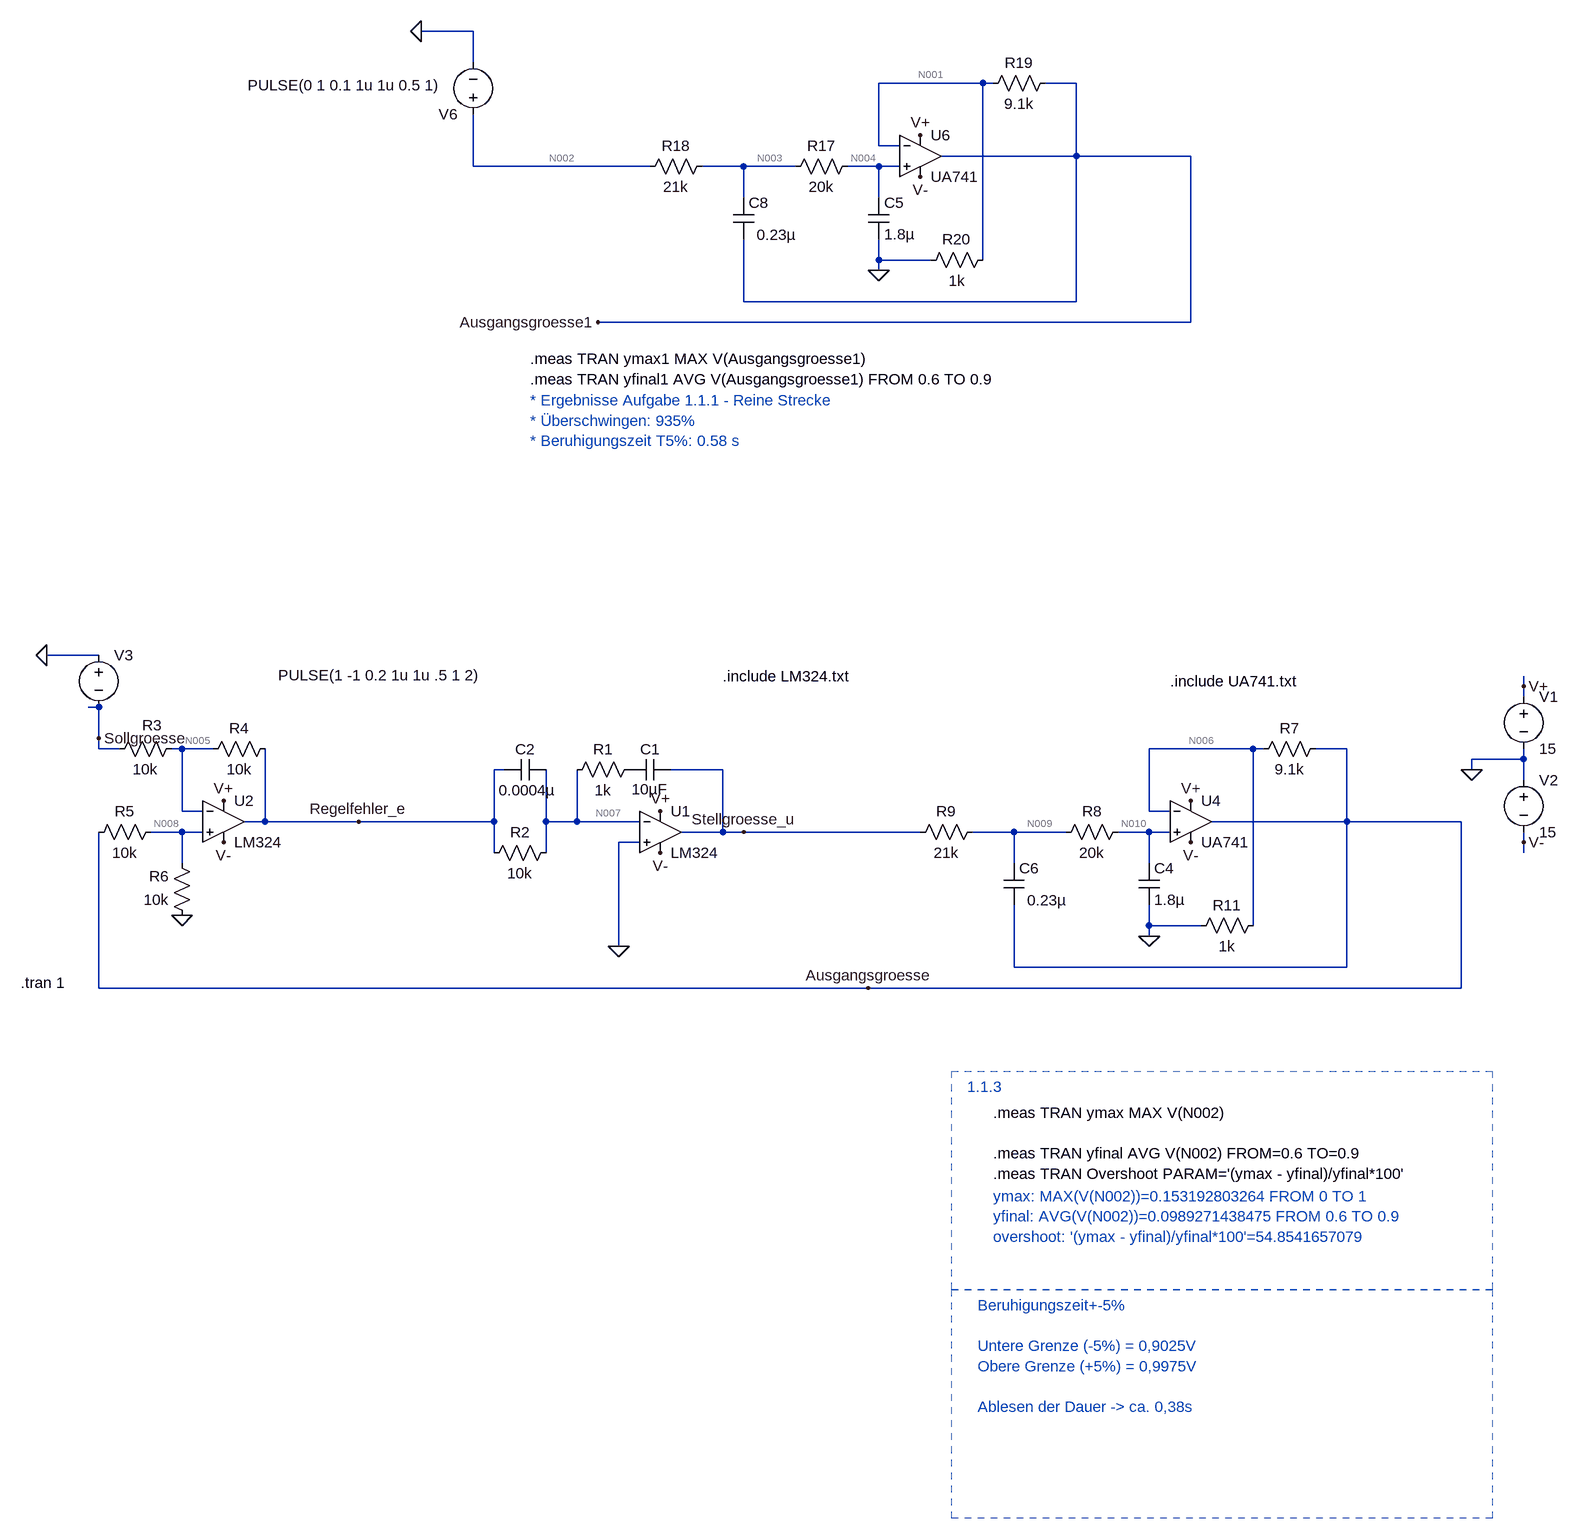
[diagram p0: schematic Reglerkreis_neu_vorlage.asc]
Reglerkreis_neu_vorlage.asc, the LTspice schematic file:
Version 4.1
SHEET 1 1480 1944
WIRE -464 -1056 -544 -1056
WIRE -464 -1008 -464 -1056
WIRE 320 -976 160 -976
WIRE 336 -976 320 -976
WIRE 464 -976 416 -976
WIRE 160 -880 160 -976
WIRE 192 -880 160 -880
WIRE 464 -864 464 -976
WIRE 464 -864 256 -864
WIRE 640 -864 464 -864
WIRE -464 -848 -464 -928
WIRE -192 -848 -464 -848
WIRE -48 -848 -112 -848
WIRE 32 -848 -48 -848
WIRE 160 -848 112 -848
WIRE 192 -848 160 -848
WIRE -48 -800 -48 -848
WIRE 160 -800 160 -848
WIRE 160 -704 160 -736
WIRE 240 -704 160 -704
WIRE 320 -704 320 -976
WIRE 160 -688 160 -704
WIRE -48 -640 -48 -736
WIRE 464 -640 464 -864
WIRE 464 -640 -48 -640
WIRE 640 -608 640 -864
WIRE 640 -608 -272 -608
WIRE -1040 -96 -1120 -96
WIRE 1152 -48 1152 -64
WIRE 1152 -32 1152 -48
WIRE -1040 -16 -1056 -16
WIRE -1040 32 -1040 -16
WIRE -1040 48 -1040 32
WIRE -1008 48 -1040 48
WIRE -912 48 -928 48
WIRE -864 48 -912 48
WIRE 736 48 576 48
WIRE 752 48 736 48
WIRE 880 48 832 48
WIRE 1152 64 1152 48
WIRE 1152 64 1072 64
WIRE -416 80 -432 80
WIRE -80 80 -160 80
WIRE 1072 80 1072 64
WIRE 1152 96 1152 64
WIRE -912 144 -912 48
WIRE -880 144 -912 144
WIRE 576 144 576 48
WIRE 608 144 576 144
WIRE -784 160 -784 48
WIRE -784 160 -816 160
WIRE -640 160 -784 160
WIRE -432 160 -432 80
WIRE -432 160 -640 160
WIRE -352 160 -352 80
WIRE -304 160 -304 80
WIRE -304 160 -352 160
WIRE -208 160 -304 160
WIRE 880 160 880 48
WIRE 880 160 672 160
WIRE 1056 160 880 160
WIRE -912 176 -960 176
WIRE -880 176 -912 176
WIRE -80 176 -80 80
WIRE -80 176 -144 176
WIRE -48 176 -80 176
WIRE 224 176 -48 176
WIRE 368 176 304 176
WIRE 448 176 368 176
WIRE 576 176 528 176
WIRE 608 176 576 176
WIRE -208 192 -240 192
WIRE 1152 192 1152 176
WIRE -432 208 -432 160
WIRE -352 208 -352 160
WIRE 1152 208 1152 192
WIRE -912 224 -912 176
WIRE 368 224 368 176
WIRE 576 224 576 176
WIRE 576 320 576 288
WIRE 656 320 576 320
WIRE 736 320 736 48
WIRE 576 336 576 320
WIRE -240 352 -240 192
WIRE 368 384 368 288
WIRE 880 384 880 160
WIRE 880 384 368 384
WIRE -1040 416 -1040 176
WIRE 144 416 -1040 416
WIRE 1056 416 1056 160
WIRE 1056 416 144 416
FLAG 1072 80 0
FLAG 1152 -48 V+
FLAG 1152 192 V-
FLAG -176 144 V+
FLAG -176 208 V-
FLAG -48 176 Stellgroesse_u
FLAG -848 128 V+
FLAG 640 128 V+
FLAG -848 192 V-
FLAG 640 192 V-
FLAG -912 304 0
FLAG -640 160 Regelfehler_e
FLAG 576 336 0
FLAG -1120 -96 0
FLAG 144 416 Ausgangsgroesse
FLAG -240 352 0
FLAG -1040 32 Sollgroesse
FLAG 224 -896 V+
FLAG 224 -832 V-
FLAG 160 -688 0
FLAG -544 -1056 0
FLAG -272 -608 Ausgangsgroesse1
SYMBOL voltage 1152 -48 R0
WINDOW 123 0 0 Left 2
WINDOW 39 0 0 Left 2
SYMATTR InstName V1
SYMATTR Value 15
SYMBOL voltage 1152 80 R0
WINDOW 123 0 0 Left 2
WINDOW 39 0 0 Left 2
SYMATTR InstName V2
SYMATTR Value 15
SYMBOL Opamps\\opamp2 -176 112 R0
SYMATTR InstName U1
SYMATTR Value LM324
SYMBOL res -208 64 R90
WINDOW 0 0 56 VBottom 2
WINDOW 3 32 56 VTop 2
SYMATTR InstName R1
SYMATTR Value 1k
SYMBOL res -336 192 R90
WINDOW 0 0 56 VBottom 2
WINDOW 3 32 56 VTop 2
SYMATTR InstName R2
SYMATTR Value 10k
SYMBOL cap -160 64 R90
WINDOW 0 0 32 VBottom 2
WINDOW 3 46 32 VCenter 2
SYMATTR InstName C1
SYMATTR Value 10µF
SYMBOL Opamps\\opamp2 -848 96 R0
SYMATTR InstName U2
SYMATTR Value LM324
SYMBOL res -912 32 R90
WINDOW 0 -5 46 VBottom 2
WINDOW 3 32 56 VTop 2
SYMATTR InstName R3
SYMATTR Value 10k
SYMBOL res -768 32 R90
WINDOW 0 0 56 VBottom 2
WINDOW 3 32 56 VTop 2
SYMATTR InstName R4
SYMATTR Value 10k
SYMBOL res -944 160 R90
WINDOW 0 0 56 VBottom 2
WINDOW 3 32 56 VTop 2
SYMATTR InstName R5
SYMATTR Value 10k
SYMBOL res -896 320 R180
WINDOW 0 36 76 Left 2
WINDOW 3 36 40 Left 2
SYMATTR InstName R6
SYMATTR Value 10k
SYMBOL res 544 160 R90
WINDOW 0 0 56 VBottom 2
WINDOW 3 32 56 VTop 2
SYMATTR InstName R8
SYMATTR Value 20k
SYMBOL res 320 160 R90
WINDOW 0 0 56 VBottom 2
WINDOW 3 32 56 VTop 2
SYMATTR InstName R9
SYMATTR Value 21k
SYMBOL cap 560 224 R0
SYMATTR InstName C4
SYMATTR Value 1.8µ
SYMBOL voltage -1040 -112 R0
WINDOW 123 0 0 Left 2
WINDOW 39 0 0 Left 2
WINDOW 3 276 47 Left 2
SYMATTR Value PULSE(1 -1 0.2 1u 1u .5 1 2)
SYMATTR InstName V3
SYMBOL cap -352 64 R90
WINDOW 0 0 32 VBottom 2
WINDOW 3 32 29 VTop 2
SYMATTR InstName C2
SYMATTR Value 0.0004µ
SYMBOL cap 352 224 R0
WINDOW 3 36 57 Left 2
SYMATTR Value 0.23µ
SYMATTR InstName C6
SYMBOL res 848 32 R90
WINDOW 0 0 56 VBottom 2
WINDOW 3 32 56 VTop 2
SYMATTR InstName R7
SYMATTR Value 9.1k
SYMBOL res 752 304 R90
WINDOW 0 0 56 VBottom 2
WINDOW 3 32 56 VTop 2
SYMATTR InstName R11
SYMATTR Value 1k
SYMBOL Opamps\\opamp2 640 96 R0
SYMATTR InstName U4
SYMATTR Value UA741
SYMBOL res 128 -864 R90
WINDOW 0 0 56 VBottom 2
WINDOW 3 32 56 VTop 2
SYMATTR InstName R17
SYMATTR Value 20k
SYMBOL res -96 -864 R90
WINDOW 0 0 56 VBottom 2
WINDOW 3 32 56 VTop 2
SYMATTR InstName R18
SYMATTR Value 21k
SYMBOL cap 144 -800 R0
SYMATTR InstName C5
SYMATTR Value 1.8µ
SYMBOL voltage -464 -912 R180
WINDOW 123 0 0 Left 2
WINDOW 39 0 0 Left 2
WINDOW 3 50 61 Left 2
SYMATTR Value PULSE(0 1 0.1 1u 1u 0.5 1)
SYMATTR InstName V6
SYMBOL cap -64 -800 R0
WINDOW 3 36 57 Left 2
SYMATTR Value 0.23µ
SYMATTR InstName C8
SYMBOL res 432 -992 R90
WINDOW 0 0 56 VBottom 2
WINDOW 3 32 56 VTop 2
SYMATTR InstName R19
SYMATTR Value 9.1k
SYMBOL res 336 -720 R90
WINDOW 0 0 56 VBottom 2
WINDOW 3 32 56 VTop 2
SYMATTR InstName R20
SYMATTR Value 1k
SYMBOL Opamps\\opamp2 224 -928 R0
SYMATTR InstName U6
SYMATTR Value UA741
TEXT -80 -64 Left 2 !.include LM324.txt
TEXT -1160 408 Left 2 !.tran 1
TEXT 608 -56 Left 2 !.include UA741.txt
TEXT 336 608 Left 2 !.meas TRAN ymax MAX V(N002)\n\n.meas TRAN yfinal AVG V(N002) FROM=0.6 TO=0.9\n.meas TRAN Overshoot PARAM='(ymax - yfinal)/yfinal*100'
TEXT 336 736 Left 2 ;ymax: MAX(V(N002))=0.153192803264 FROM 0 TO 1\nyfinal: AVG(V(N002))=0.0989271438475 FROM 0.6 TO 0.9\novershoot: '(ymax - yfinal)/yfinal*100'=54.8541657079
TEXT 312 904 Left 2 ;Beruhigungszeit+-5%\n \nUntere Grenze (-5%) = 0,9025V\nObere Grenze (+5%) = 0,9975V\n \nAblesen der Dauer -> ca. 0,38s
TEXT 296 568 Left 2 ;1.1.3
TEXT -376 -552 Left 2 !.meas TRAN ymax1 MAX V(Ausgangsgroesse1)\n.meas TRAN yfinal1 AVG V(Ausgangsgroesse1) FROM 0.6 TO 0.9
TEXT -376 -488 Left 2 ;* Ergebnisse Aufgabe 1.1.1 - Reine Strecke\n* Überschwingen: 935%\n* Beruhigungszeit T5%: 0.58 s
RECTANGLE Normal 1104 880 272 544 2
RECTANGLE Normal 1104 1232 272 880 2

The netlist it stands for:
* Reglerkreis_neu_vorlage.asc
V1 V+ 0 15
V2 0 V- 15
X§U1 0 N007 V+ V- Stellgroesse_u LM324  ; pins In+ In- V+ V- OUT
R1 P001 N007 1k
R2 N007 Regelfehler_e 10k
C1 Stellgroesse_u P001 10µF
X§U2 N008 N005 V+ V- Regelfehler_e LM324  ; pins In+ In- V+ V- OUT
R3 N005 Sollgroesse 10k
R4 Regelfehler_e N005 10k
R5 N008 Ausgangsgroesse 10k
R6 0 N008 10k
R8 N010 N009 20k
R9 N009 Stellgroesse_u 21k
C4 N010 0 1.8µ
V3 0 Sollgroesse PULSE(1 -1 0.2 1u 1u .5 1 2)
C2 N007 Regelfehler_e 0.0004µ
C6 N009 Ausgangsgroesse 0.23µ
R7 Ausgangsgroesse N006 9.1k
R11 N006 0 1k
X§U4 N010 N006 V+ V- Ausgangsgroesse UA741  ; pins In+ In- V+ V- OUT
R17 N004 N003 20k
R18 N003 N002 21k
C5 N004 0 1.8µ
V6 N002 0 PULSE(0 1 0.1 1u 1u 0.5 1)
C8 N003 Ausgangsgroesse1 0.23µ
R19 Ausgangsgroesse1 N001 9.1k
R20 N001 0 1k
X§U6 N004 N001 V+ V- Ausgangsgroesse1 UA741  ; pins In+ In- V+ V- OUT
.include LM324.txt
.tran 1
.include UA741.txt
.meas TRAN ymax MAX V(N002)
.meas TRAN yfinal AVG V(N002) FROM=0.6 TO=0.9
.meas TRAN Overshoot PARAM='(ymax - yfinal)/yfinal*100'
* ymax: MAX(V(N002))=0.153192803264 FROM 0 TO 1
* yfinal: AVG(V(N002))=0.0989271438475 FROM 0.6 TO 0.9
* overshoot: '(ymax - yfinal)/yfinal*100'=54.8541657079
* Beruhigungszeit+-5%
* Untere Grenze (-5%) = 0,9025V
* Obere Grenze (+5%) = 0,9975V
* Ablesen der Dauer -> ca. 0,38s
* 1.1.3
.meas TRAN ymax1 MAX V(Ausgangsgroesse1)
.meas TRAN yfinal1 AVG V(Ausgangsgroesse1) FROM 0.6 TO 0.9
* * Ergebnisse Aufgabe 1.1.1 - Reine Strecke
* * Überschwingen: 935%
* * Beruhigungszeit T5%: 0.58 s
.backanno
.end

* Results of the author's LTspice run, read from the files saved beside the schematic
* Operating Point, zero values left out:
*   V(v-) = -15 V
*   V(stellgroesse_u) = -95.86 mV
*   V(p001) = -32.69 µV
*   V(n008) = -500 mV
*   V(ausgangsgroesse) = -1 V
*   V(n009) = -97.54 mV
*   V(n006) = -99.1 mV
*   V(n003) = -1.674 mV
*   V(n001) = -3.249 mV
*   V(v+) = 15 V
*   V(n007) = -32.69 µV
*   V(regelfehler_e) = -232 µV
*   V(n005) = -500 mV
*   V(sollgroesse) = -1 V
*   V(n010) = -99.13 mV
*   V(n004) = -3.269 mV
*   V(ausgangsgroesse1) = -32.09 mV
*   I(V1) = -5.333 mA
*   I(R2) = 19.93 nA
*   I(R3) = 50 µA
*   I(R5) = 50.02 µA
*   I(R6) = 50 µA
*   I(R9) = -79.68 nA
*   I(R7) = -99.02 µA
*   I(V3) = -50 µA
*   I(R17) = -79.72 nA
*   I(R19) = -3.169 µA
*   I(R4) = 49.98 µA
*   I(R8) = -79.68 nA
*   I(R11) = -99.1 µA
*   I(R18) = -79.72 nA
*   I(R20) = -3.249 µA
*   I(V2) = -5.334 mA
*   I(V6) = -79.72 nA